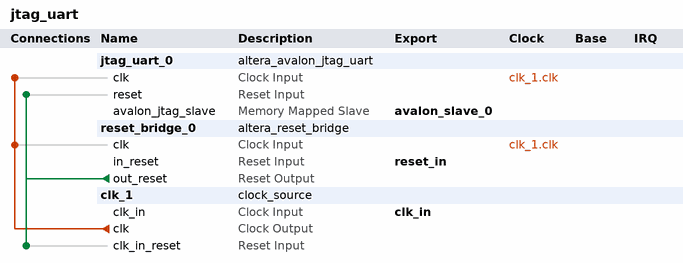
[diagram p0: system contents]
# Platform Designer (Qsys) system jtag_uart, Cyclone II EP2C20F484C7
# Parameters at their usual value, and those the tool derives, are not listed.
package require -exact qsys 13.0
create_system jtag_uart
set_project_property DEVICE_FAMILY {Cyclone II}
set_project_property DEVICE EP2C20F484C7

add_instance jtag_uart_0 altera_avalon_jtag_uart 13.0.1.99.2
set_instance_parameter_value jtag_uart_0 simInteractiveOptions NO_INTERACTIVE_WINDOWS

add_instance reset_bridge_0 altera_reset_bridge 13.0
set_instance_parameter_value reset_bridge_0 ACTIVE_LOW_RESET 0
set_instance_parameter_value reset_bridge_0 SYNCHRONOUS_EDGES deassert

add_instance clk_1 clock_source 13.0
set_instance_parameter_value clk_1 clockFrequency 50000000

# connections
add_connection clk_1.clk jtag_uart_0.clk clock
add_connection clk_1.clk reset_bridge_0.clk clock
add_connection reset_bridge_0.out_reset clk_1.clk_in_reset reset
add_connection reset_bridge_0.out_reset jtag_uart_0.reset reset

# exported interfaces
add_interface avalon_slave_0 avalon slave
set_interface_property avalon_slave_0 EXPORT_OF jtag_uart_0.avalon_jtag_slave
add_interface clk_in clock sink
set_interface_property clk_in EXPORT_OF clk_1.clk_in
add_interface reset_in reset sink
set_interface_property reset_in EXPORT_OF reset_bridge_0.in_reset

set_interconnect_requirement {$system} qsys_mm.clockCrossingAdapter HANDSHAKE
set_interconnect_requirement {$system} qsys_mm.maxAdditionalLatency 1

save_system jtag_uart.qsys
